# Altium project CreationByte_DevBoard_v1.PrjPcb (part 2 of 2)
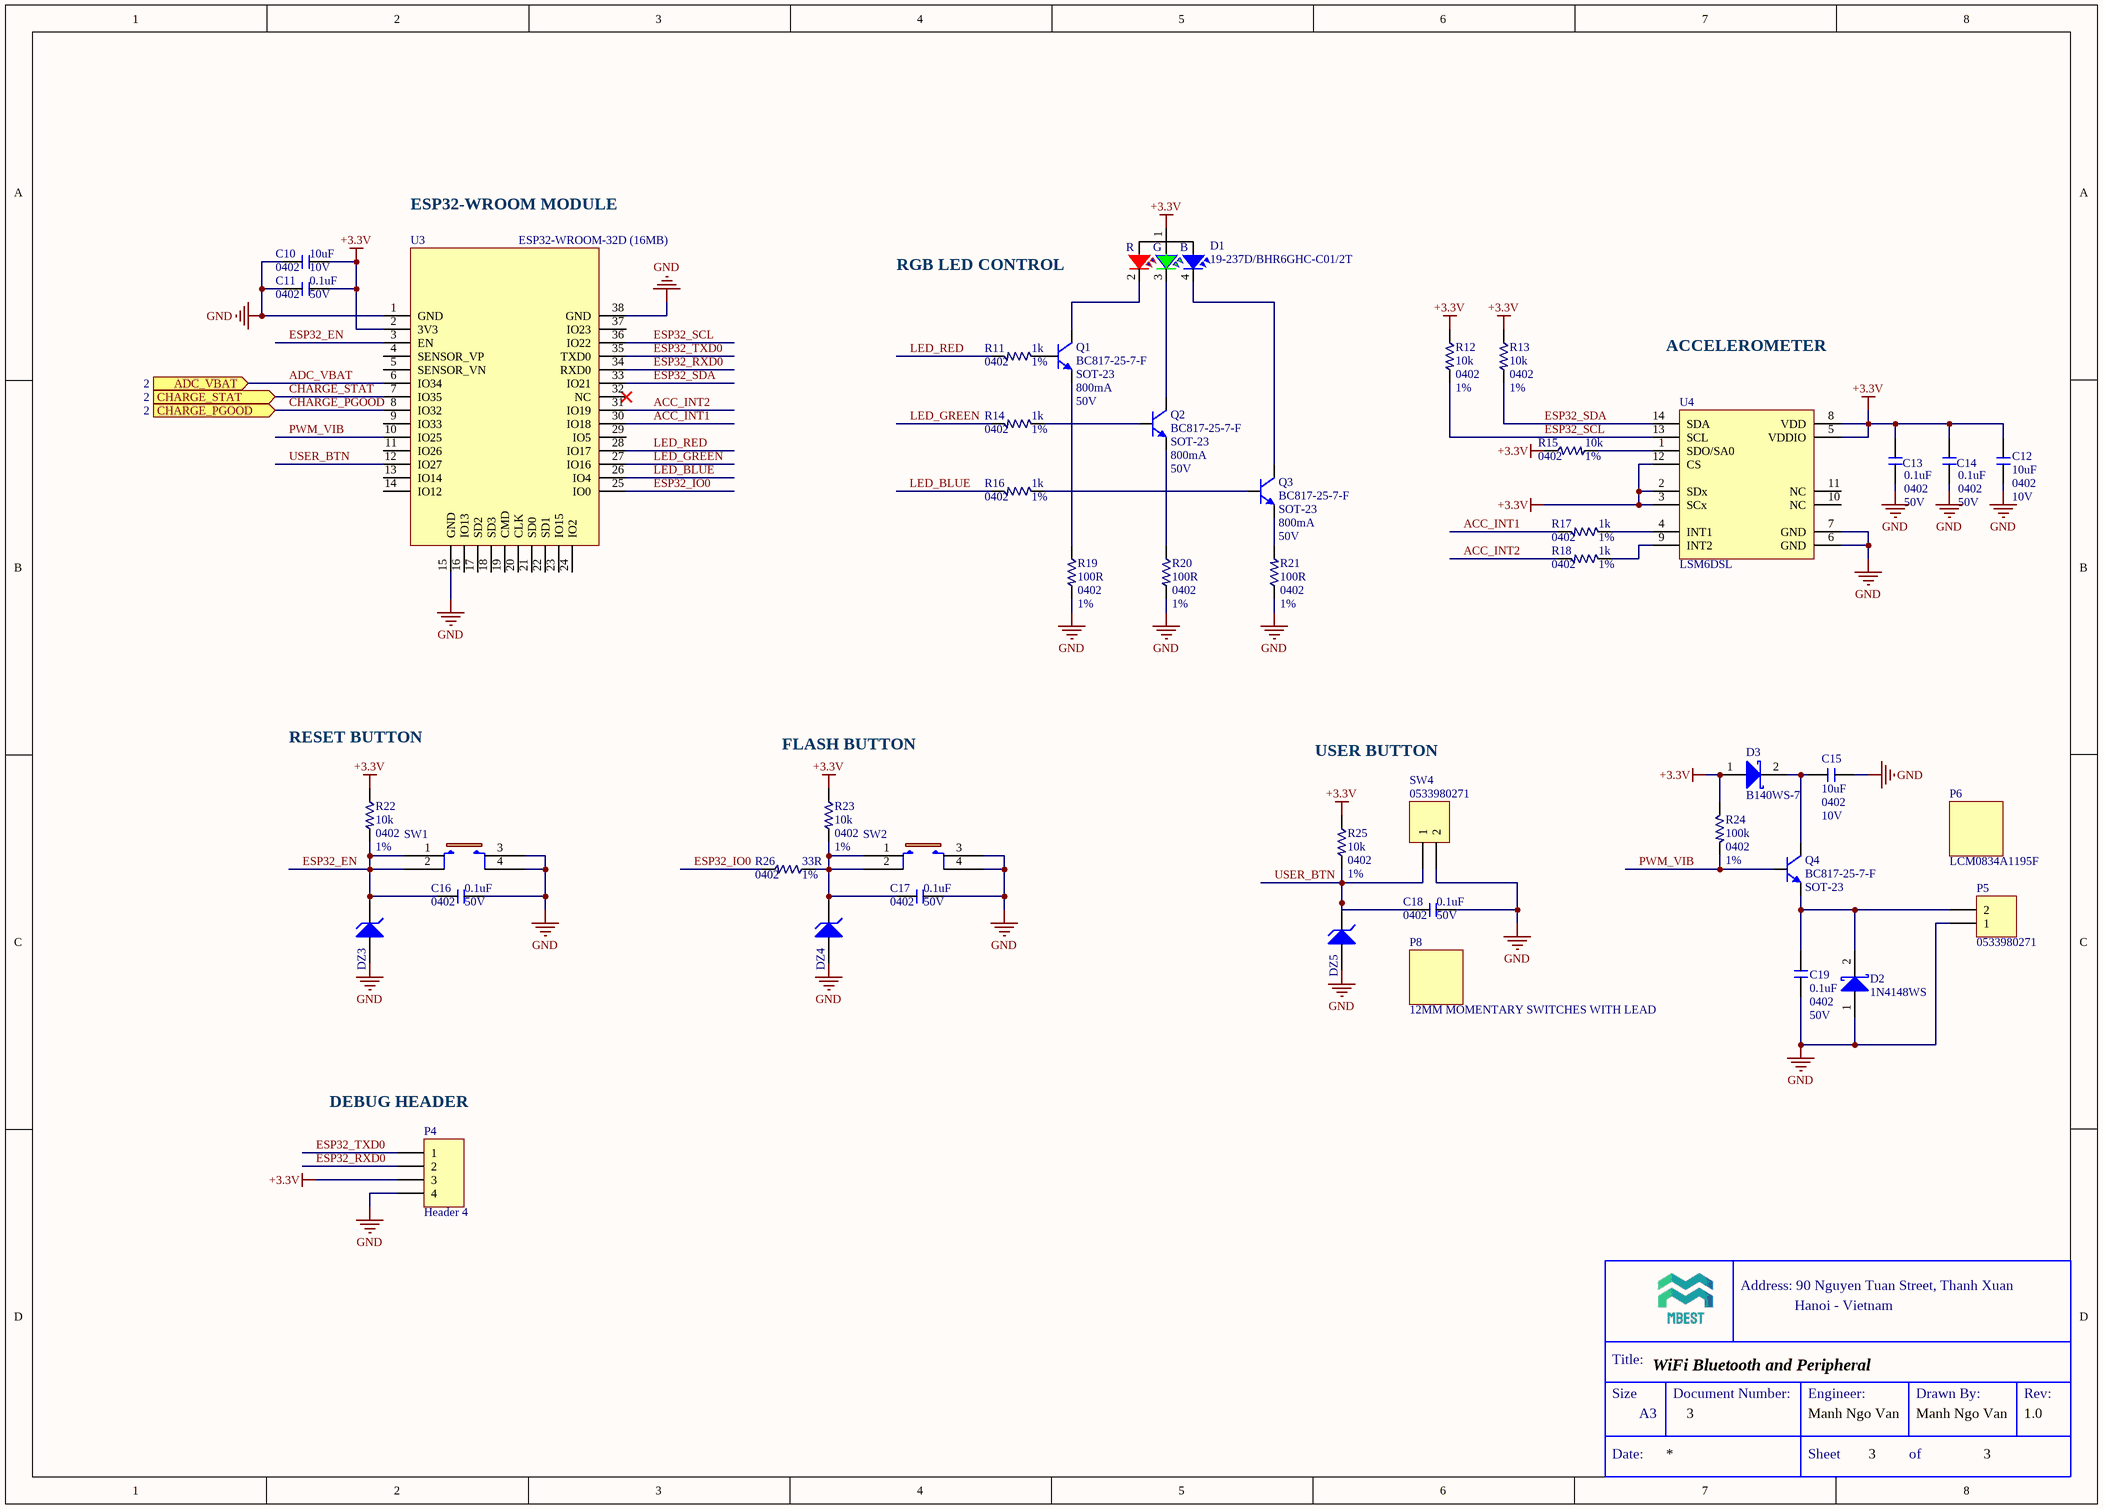
[diagram p3: ESP32.SchDoc]

## Sheet ESP32.SchDoc: WiFi Bluetooth and Peripheral (continued)

### Library data of the parts
C10 C12 C15 = CAP_CER: CAP CER 10UF 10V X5R 0402; Manufacturer 1: Samsung; Manufacturer Part Number 1: CL05A106MP8NUB8; Mouting Technology: SMT; Tolerance: 20%; Pin: 2; Supplier 1: Digi-Key; Supplier Part Number 1: 1276-6830-6-ND; RoHS: Yes; Category: Ceramic Capacitors; Stock 1: 5372550; Pricing 1: 1=0.37000, 10=0.25800, 50=0.18040, 100=0.15460, 500=0.11598, 1000=0.09793, 2500=0.09278 (USD); Mount: Surface Mount; Case Code (Metric): 1005; Case Code (Imperial): 0402; Min Operating Temperature: -55°C; Max Operating Temperature: 85°C; Packaging: Tape and Reel; Capacitance: 10uF; Length: 0.039inch; Width: 0.02inch; Thickness: 0.035inch; RoHS Compliant: Yes; ComponentLink1URL: http://www.samsungsem.com/kr/support/product-search/mlcc/CL05A106MP8NUB8.jsp?src-supplier=Digi-Key; ComponentLink1Description: http://www.samsungsem.com/kr/support/product-search/mlcc/CL05A106MP8NUB8.jsp?src-supplier=Digi-Key
C11 C13 C14 C16-C19 = CAP_CER: CAP CER 0.1UF 50V X7R 0402; Manufacturer: Murata; Manufacturer Part Number: GRM155R71H104KE14D; Material: Ceramic; Tolerance: 10%; Capacitance: 100nF; Dissipation Factor: 0.025%; ComponentLink1URL: https://datasheet.ciiva.com/25741/cl10b104kb8nnnl-25741341.pdf?src-supplier=Digi-Key; ComponentLink1Description: https://datasheet.ciiva.com/25741/cl10b104kb8nnnl-25741341.pdf?src-supplier=Digi-Key; ComponentLink2URL: https://datasheet.ciiva.com/26838/getdatasheetpartid-357523-26838415.pdf?src-supplier=Verical; ComponentLink2Description: https://datasheet.ciiva.com/26838/getdatasheetpartid-357523-26838415.pdf?src-supplier=Verical; Supplier 1: Digi-Key; Supplier Part Number 1: 490-10700-1-ND; Stock 1: 2282266; Pricing 1: 1 = 0.10000, 10 = 0.04600, 100 = 0.02050, 500 = 0.01464, 1000 = 0.01150, 2500 = 0.01045, 5000 = 0.00961 (USD); RoHS: Yes; Mount: Surface Mount; Weight: 0.000212oz; Case Code (Metric): 1005; Case Code (Imperial): 0402; Dielectric Material: Ceramic; Min Operating Temperature: -55°C; Max Operating Temperature: 125°C; Packaging: Tape and Reel; Dielectric: X7R; Voltage Rating: 50V; Termination: SMD/SMT; Composition: Ceramic; Voltage Rating (DC): 50V; Package Quantity: 10000; Length: 1mm; Height: 0.5mm; Width: 0.5mm; Thickness: 0.022inch; Depth: 0.5mm; REACH SVHC: No SVHC; Lead Free: Lead Free; ComponentLink3URL: http://www.farnell.com/datasheets/2079156.pdf?src-supplier=Farnell; ComponentLink3Description: http://www.farnell.com/datasheets/2079156.pdf?src-supplier=Farnell; ComponentLink4URL: http://www.mouser.com/ds/2/281/c02e-2905.pdf?src-supplier=Mouser; ComponentLink4Description: http://www.mouser.com/ds/2/281/c02e-2905.pdf?src-supplier=Mouser; ComponentLink5URL: http://components.arrow.com/part/dataview/0323_07030614?src-supplier=Arrow+Europe; ComponentLink5Description: http://components.arrow.com/part/dataview/0323_07030614?src-supplier=Arrow+Europe; ComponentLink6URL: https://search.murata.co.jp/Ceramy/image/img/A01X/G101/ENG/GRM155R71H104KE14-01.pdf?src-supplier=Digi-Key; ComponentLink6Description: https://search.murata.co.jp/Ceramy/image/img/A01X/G101/ENG/GRM155R71H104KE14-01.pdf?src-supplier=Digi-Key; ComponentLink7URL: http://psearch.en.murata.com/capacitor/product/GRM155R71H104KE14%23.pdf?src-supplier=Avnet; ComponentLink7Description: http://psearch.en.murata.com/capacitor/product/GRM155R71H104KE14%23.pdf?src-supplier=Avnet; ComponentLink8URL: http://www.farnell.com/datasheets/2079156.pdf?src-supplier=Element14; ComponentLink8Description: http://www.farnell.com/datasheets/2079156.pdf?src-supplier=Element14; ComponentLink9URL: http://www.farnell.com/datasheets/2079156.pdf?src-supplier=Newark; ComponentLink9Description: http://www.farnell.com/datasheets/2079156.pdf?src-supplier=Newark
D1 = 19-237D/BHR6GHC-C01/2T: LED RGB CLEAR 4SMD; Manufacturer 1: Everlight; Supplier 1: Arrow Electronics; Manufacturer Part Number 1: 19-237D/BHR6GHC-C01/2T; Pricing 1: 6000=0.27010, 8000=0.26740, 10000=0.26470, 12000=0.26210, 20000=0.25950, 24000=0.25690, 25000=0.25430, 30000=0.25180, 50000=0.24920 (USD); Supplier Part Number 1: 19-237D/BHR6GHC-C01/2T
D2 = D Schottky: DIODE GEN PURP 75V 150MA SOD323F; Manufacturer: ON Semiconductor / Fairchild; Reverse Recovery Time: 4ns; Power Dissipation: 200mW; Element Configuration: Single; Max Forward Surge Current (Ifsm): 2A; Peak Reverse Current: 5uA; Forward Voltage: 1V; ComponentLink1URL: http://www.mccsemi.com/up_pdf/1N4148X(SOD-523).PDF?src-supplier=Digi-Key; ComponentLink1Description: http://www.mccsemi.com/up_pdf/1N4148X(SOD-523).PDF?src-supplier=Digi-Key; ComponentLink2URL: http://www.mouser.com/ds/2/258/1N4148X(SOD-523)-349105.pdf?src-supplier=Mouser; ComponentLink2Description: http://www.mouser.com/ds/2/258/1N4148X(SOD-523)-349105.pdf?src-supplier=Mouser; ComponentLink3URL: http://www.mccsemi.com/up_pdf/1N4148X(SOD-523).PDF?src-supplier=Future+Electronics; ComponentLink3Description: http://www.mccsemi.com/up_pdf/1N4148X(SOD-523).PDF?src-supplier=Future+Electronics; ComponentLink4URL: https://datasheet.ciiva.com/16303/ds30217-16303296.pdf?src-supplier=Future+Electronics; ComponentLink4Description: https://datasheet.ciiva.com/16303/ds30217-16303296.pdf?src-supplier=Future+Electronics; ComponentLink5URL: https://datasheet.ciiva.com/27092/1538419-27092484.pdf?src-supplier=Jameco; ComponentLink5Description: https://datasheet.ciiva.com/27092/1538419-27092484.pdf?src-supplier=Jameco; ComponentLink6URL: https://datasheet.ciiva.com/912/ds30217-912801.pdf?src-supplier=Digi-Key; ComponentLink6Description: https://datasheet.ciiva.com/912/ds30217-912801.pdf?src-supplier=Digi-Key; ComponentLink7URL: https://datasheet.ciiva.com/1177/ds30217-1177089.pdf?src-supplier=Element14; ComponentLink7Description: https://datasheet.ciiva.com/1177/ds30217-1177089.pdf?src-supplier=Element14; ComponentLink8URL: https://datasheet.ciiva.com/912/ds30217-912802.pdf?src-supplier=Digi-Key; ComponentLink8Description: https://datasheet.ciiva.com/912/ds30217-912802.pdf?src-supplier=Digi-Key; ComponentLink9URL: https://datasheet.ciiva.com/912/ds30217-912803.pdf?src-supplier=Digi-Key; ComponentLink9Description: https://datasheet.ciiva.com/912/ds30217-912803.pdf?src-supplier=Digi-Key; ComponentLink10URL: https://datasheet.ciiva.com/8303/ds30217-8303132.pdf?src-supplier=Avnet; ComponentLink10Description: https://datasheet.ciiva.com/8303/ds30217-8303132.pdf?src-supplier=Avnet; ComponentLink11URL: https://datasheet.ciiva.com/25919/ds30217-25919644.pdf?src-supplier=Avnet+Europe; ComponentLink11Description: https://datasheet.ciiva.com/25919/ds30217-25919644.pdf?src-supplier=Avnet+Europe; Supplier 1: Digi-Key; Supplier Part Number 1: 1N4148WSFSCT-ND; Manufacturer Part Number: 1N4148WS; Stock 1: 252106; Pricing 1: 1 = 0.16000, 10 = 0.14000, 100 = 0.06610, 500 = 0.03920, 1000 = 0.02576 (USD); RoHS: Yes; Mount: Surface Mount; Number of Pins: 2; Weight: 0.0276g; Contact Plating: Tin,Matte; Min Operating Temperature: -55°C; Max Operating Temperature: 150°C; Max Repetitive Reverse Voltage (Vrrm): 75V; Packaging: Tape and Reel; Forward Current: 150mA; Average Rectified Current: 150mA; Package Quantity: 1; Recovery Time: 4ns; Reverse Voltage: 75V; Max Reverse Voltage (DC): 75V; Length: 1.8mm; Height: 1mm; Width: 1.35mm; Radiation Hardening: No; Lead Free: Lead Free; REACH SVHC: No SVHC; ComponentLink12URL: https://datasheet.ciiva.com/25968/1n914bws-25968945.pdf?src-supplier=Avnet+Europe; ComponentLink12Description: https://datasheet.ciiva.com/25968/1n914bws-25968945.pdf?src-supplier=Avnet+Europe; ComponentLink13URL: https://datasheet.ciiva.com/30479/0900766b810e1cd3-30479206.pdf?src-supplier=RSComponents; ComponentLink13Description: https://datasheet.ciiva.com/30479/0900766b810e1cd3-30479206.pdf?src-supplier=RSComponents; ComponentLink14URL: https://datasheet.ciiva.com/910/1n4148ws-910381.pdf?src-supplier=Digi-Key; ComponentLink14Description: https://datasheet.ciiva.com/910/1n4148ws-910381.pdf?src-supplier=Digi-Key; ComponentLink15URL: https://datasheet.ciiva.com/15208/getdatasheetpartid-127819-15208358.pdf?src-supplier=Verical; ComponentLink15Description: https://datasheet.ciiva.com/15208/getdatasheetpartid-127819-15208358.pdf?src-supplier=Verical; ComponentLink16URL: https://datasheet.ciiva.com/8300/1n914bws-8300360.pdf?src-supplier=Avnet; ComponentLink16Description: https://datasheet.ciiva.com/8300/1n914bws-8300360.pdf?src-supplier=Avnet; ComponentLink17URL: https://datasheet.ciiva.com/910/1n4148ws-910380.pdf?src-supplier=Digi-Key; ComponentLink17Description: https://datasheet.ciiva.com/910/1n4148ws-910380.pdf?src-supplier=Digi-Key; ComponentLink18URL: https://datasheet.ciiva.com/910/1n4148ws-910382.pdf?src-supplier=Digi-Key; ComponentLink18Description: https://datasheet.ciiva.com/910/1n4148ws-910382.pdf?src-supplier=Digi-Key
D3 = D Schottky: DIODE SCHOTTKY 40V 1A SOD323; Manufacturer 1: Diodes; Max Reverse Current: 50uA; Peak Non-Repetitive Surge Current: 3A; Element Configuration: Single; Forward Voltage: 620mV; Natural Thermal Resistance: 426°C/W; Supplier 1: Digi-Key; Supplier Part Number 1: B140WS-7DICT-ND; Manufacturer Part Number 1: B140WS-7; RoHS: Yes; Category: Rectifier Diodes; Stock 1: 30918; Pricing 1: 1=0.43000, 10=0.32200, 100=0.20060, 500=0.13728, 1000=0.10560 (USD); Mount: Surface Mount; Number of Pins: 2; Weight: 0.000173oz; Contact Plating: Tin,Matte; Min Operating Temperature: -40°C; Max Operating Temperature: 125°C; Forward Current: 1A; Max Repetitive Reverse Voltage (Vrrm): 40V; Package Quantity: 3000; Packaging: Tape and Reel; Average Rectified Current: 1A; Max Forward Surge Current (Ifsm): 3A; Max Reverse Voltage (DC): 40V; Series: -; Length: 1.8mm; Width: 1.4mm; Height: 1.1mm; RoHS Compliant: Yes; ComponentLink1URL: https://datasheet.ciiva.com/13064/ds31543-56649-13064032.pdf?src-supplier=Mouser; ComponentLink1Description: https://datasheet.ciiva.com/13064/ds31543-56649-13064032.pdf?src-supplier=Mouser; ComponentLink2URL: https://datasheet.ciiva.com/18567/ds31543-18567697.pdf?src-supplier=Digi-Key; ComponentLink2Description: https://datasheet.ciiva.com/18567/ds31543-18567697.pdf?src-supplier=Digi-Key; ComponentLink3URL: https://datasheet.ciiva.com/25946/ds31543-25946915.pdf?src-supplier=Avnet+Europe; ComponentLink3Description: https://datasheet.ciiva.com/25946/ds31543-25946915.pdf?src-supplier=Avnet+Europe
DZ3-DZ5 = D Zener: TVS DIODE 5.5V 14V 2X1SON; Manufacturer: Texas Instruments; Capacitance: 12pF; Direction: Bidirectional; Breakdown Voltage: 6V; Number of Channels: 1; Peak Pulse Power: 90W; Power Line Protection: No; Leakage Current: 100nA; ESD Protection: Yes; Test Current: 1mA; Element Configuration: Single; Peak Pulse Current: 5A; Interface: GPIO; Supplier 1: Digi-Key; Supplier Part Number 1: 296-30406-1-ND; Manufacturer Part Number: TPD1E10B06DPYR; Stock 1: 555750; Pricing 1: 1 = 0.45000, 10 = 0.29400, 100 = 0.16380, 500 = 0.10920, 1000 = 0.07560, 5000 = 0.07350 (USD); RoHS: Yes; Case/Package: 0402; Number of Pins: 2; Contact Plating: Gold; Min Operating Temperature: -40°C; Max Operating Temperature: 125°C; Package Quantity: 1; Packaging: Tape and Reel; Number of Bidirectional Channels: 1; Reverse Standoff Voltage: 5.5V; Min Breakdown Voltage: 6V; Clamping Voltage: 14V; Working Voltage: 5.5V; Max Reverse Leakage Current: 100nA; Resistor Type: Zener; Length: 1.1mm; Height: 0.35mm; Width: 0.7mm; Radiation Hardening: No; REACH SVHC: No SVHC; Lead Free: Lead Free; ComponentLink1URL: https://datasheet.ciiva.com/26005/sllseb1b-26005840.pdf?src-supplier=Avnet+Europe; ComponentLink1Description: https://datasheet.ciiva.com/26005/sllseb1b-26005840.pdf?src-supplier=Avnet+Europe; ComponentLink2URL: https://datasheet.ciiva.com/46384/1877100-46384054.pdf?src-supplier=Element14; ComponentLink2Description: https://datasheet.ciiva.com/46384/1877100-46384054.pdf?src-supplier=Element14; ComponentLink3URL: https://datasheet.ciiva.com/14195/tpd1e10b06-14195178.pdf?src-supplier=Avnet; ComponentLink3Description: https://datasheet.ciiva.com/14195/tpd1e10b06-14195178.pdf?src-supplier=Avnet; ComponentLink4URL: https://datasheet.ciiva.com/22691/1877100-22691786.pdf?src-supplier=Element14; ComponentLink4Description: https://datasheet.ciiva.com/22691/1877100-22691786.pdf?src-supplier=Element14; ComponentLink5URL: https://datasheet.ciiva.com/2961/tpd1e10b06-2961245.pdf?src-supplier=Digi-Key; ComponentLink5Description: https://datasheet.ciiva.com/2961/tpd1e10b06-2961245.pdf?src-supplier=Digi-Key; ComponentLink6URL: https://datasheet.ciiva.com/2961/tpd1e10b06-2961246.pdf?src-supplier=Digi-Key; ComponentLink6Description: https://datasheet.ciiva.com/2961/tpd1e10b06-2961246.pdf?src-supplier=Digi-Key; ComponentLink7URL: https://datasheet.ciiva.com/6574/tpd1e10b06-6574654.pdf?src-supplier=Digi-Key; ComponentLink7Description: https://datasheet.ciiva.com/6574/tpd1e10b06-6574654.pdf?src-supplier=Digi-Key
P4 = Header 4: Header, 4-Pin; LatestRevisionDate: 17-Jul-2002; LatestRevisionNote: Re-released for DXP Platform.; Publisher: Altium Limited
P5 SW4 = Header 2: CONN HEADER SMD 2POS 1.25MM; Manufacturer 1: Molex; Manufacturer Part Number 1: 53398-0271; Current Rating: 1A; Voltage Rating (AC): 125V; Contact Resistance: 20mR; Number of Positions: 2; Insulation Resistance: 100MR; Gender: Male; Glow Wire Compliant: Non-compliant; LatestRevisionDate: 17-Jul-2002; LatestRevisionNote: Re-released for DXP Platform.; Publisher: Altium Limited; Supplier 1: Digi-Key; Supplier Part Number 1: WM7606CT-ND; RoHS: Yes; Category: Headers and Wire Housings; Stock 1: 417; Pricing 1: 1=0.53000, 10=0.44900, 100=0.34940 (USD); Mount: Surface Mount; Contact Material: Bronze,Brass,Tin; Contact Plating: Tin; Color: Natural; Housing Color: Natural; Housing Material: Nylon; Min Operating Temperature: -40°C; Max Operating Temperature: 85°C; Number of Rows: 1; Packaging: Tape and Reel; Package Quantity: 1000; Voltage Rating: 125V; Termination: Solder; Number of Contacts: 2; Working Voltage: 125V; Orientation: Vertical; Number of Circuits: 2; Voltage Rating (DC): 125V; Series: PicoBlade; Contact Type: Blade Pin; Pitch: 1.25mm; Depth: 4.2mm; Radiation Hardening: No; RoHS Compliant: Yes; REACH SVHC: Unknown; Lead Free: Lead Free; Flammability Rating: UL94 V-0; ComponentLink1URL: https://datasheet.ciiva.com/7167/1626130-7167520.pdf?src-supplier=Newark; ComponentLink1Description: https://datasheet.ciiva.com/7167/1626130-7167520.pdf?src-supplier=Newark; ComponentLink2URL: https://datasheet.ciiva.com/7920/1841150-7920834.pdf?src-supplier=Element14; ComponentLink2Description: https://datasheet.ciiva.com/7920/1841150-7920834.pdf?src-supplier=Element14; ComponentLink3URL: https://datasheet.ciiva.com/14156/gf116833-116846-e-14156243.pdf?src-supplier=Distrelec; ComponentLink3Description: https://datasheet.ciiva.com/14156/gf116833-116846-e-14156243.pdf?src-supplier=Distrelec; ComponentLink4URL: https://datasheet.ciiva.com/36178/1932619-36178944.pdf?src-supplier=Jameco; ComponentLink4Description: https://datasheet.ciiva.com/36178/1932619-36178944.pdf?src-supplier=Jameco; ComponentLink5URL: https://datasheet.ciiva.com/28523/1759360-28523372.pdf?src-supplier=Element14; ComponentLink5Description: https://datasheet.ciiva.com/28523/1759360-28523372.pdf?src-supplier=Element14; ComponentLink6URL: https://datasheet.ciiva.com/9468/0533980271-pcb-headers-9468512.pdf?src-supplier=Avnet; ComponentLink6Description: https://datasheet.ciiva.com/9468/0533980271-pcb-headers-9468512.pdf?src-supplier=Avnet; ComponentLink7URL: https://datasheet.ciiva.com/30229/225140533980271-pcb-headers-30229043.pdf?src-supplier=Onlinecomponents.com; ComponentLink7Description: https://datasheet.ciiva.com/30229/225140533980271-pcb-headers-30229043.pdf?src-supplier=Onlinecomponents.com; ComponentLink8URL: https://datasheet.ciiva.com/5150/0533980271-pcb-headers-146564-5150549.pdf?src-supplier=Mouser; ComponentLink8Description: https://datasheet.ciiva.com/5150/0533980271-pcb-headers-146564-5150549.pdf?src-supplier=Mouser; ComponentLink9URL: https://datasheet.ciiva.com/11746/0900766b80ab946a-11746463.pdf?src-supplier=RSComponents; ComponentLink9Description: https://datasheet.ciiva.com/11746/0900766b80ab946a-11746463.pdf?src-supplier=RSComponents; ComponentLink10URL: https://datasheet.ciiva.com/22707/1867379-22707654.pdf?src-supplier=Element14; ComponentLink10Description: https://datasheet.ciiva.com/22707/1867379-22707654.pdf?src-supplier=Element14; ComponentLink11URL: https://datasheet.ciiva.com/22683/1626130-22683563.pdf?src-supplier=Element14; ComponentLink11Description: https://datasheet.ciiva.com/22683/1626130-22683563.pdf?src-supplier=Element14; ComponentLink12URL: https://datasheet.ciiva.com/16658/0533980271-pcb-headers-16658429.pdf?src-supplier=Avnet+Europe; ComponentLink12Description: https://datasheet.ciiva.com/16658/0533980271-pcb-headers-16658429.pdf?src-supplier=Avnet+Europe; ComponentLink13URL: https://datasheet.ciiva.com/18454/70090670-18454279.pdf?src-supplier=Allied+Electronics; ComponentLink13Description: https://datasheet.ciiva.com/18454/70090670-18454279.pdf?src-supplier=Allied+Electronics
P6 = ADDITION: Coin Type Vibration Motor; Manufacturer 1: LEADER; Manufacturer Part Number 1: LCM0834A1195F
P8 = ADDITION: Manufacturer 1: Yueqing Taixin Electric Co; Manufacturer Part Number 1: 12MM MOMENTARY SWITCHES WITH LEAD; ComponentLink1Description: New link; ComponentLink1URL: https://www.alibaba.com/product-detail/12mm-16mm-19mm-22mm-reset-screw_60833334002.html?spm=a2700.galleryofferlist.normal_offer.d_title.6c1e33b1BOO0Mu
Q1-Q3 = MMBT3904-7-F: TRANS NPN 45V 500MA SOT23-3; Manufacturer 1: Diodes; Max Power Dissipation: 310mW; Number of Elements: 1; Frequency: 100MHz; Emitter Base Voltage (VEBO): 5V; Collector Emitter Saturation Voltage: 700mV; Max Breakdown Voltage: 150V; Power Dissipation: 350mW; Element Configuration: Single; Supplier 1: Digi-Key; Supplier Part Number 1: BC817-25FDICT-ND; Manufacturer Part Number 1: BC817-25-7-F; Stock 1: 52922; Pricing 1: 1 = 0.20000, 10 = 0.16300, 25 = 0.13640, 100 = 0.06670, 250 = 0.06560, 500 = 0.05560, 1000 = 0.03863 (USD); RoHS: Yes; Mount: Surface Mount; Number of Pins: 3; Weight: 0.000282oz; Contact Plating: Tin; Min Operating Temperature: -65°C; Max Operating Temperature: 150°C; Collector Emitter Voltage (VCEO): 45V; Polarity: NPN; Packaging: Tape and Reel; Collector Emitter Breakdown Voltage: 45V; Package Quantity: 3000; Transition Frequency: 100MHz; Max Frequency: 100MHz; Gain Bandwidth Product: 100MHz; Length: 3.05mm; Height: 1mm; Width: 1.4mm; Radiation Hardening: No; REACH SVHC: No SVHC; Lead Free: Lead Free; ComponentLink1URL: https://datasheet.ciiva.com/15139/getdatasheetpartid-233998-15139790.pdf?src-supplier=Verical; ComponentLink1Description: https://datasheet.ciiva.com/15139/getdatasheetpartid-233998-15139790.pdf?src-supplier=Verical; Manufacturer: Diodes; Manufacturer Part Number: BC817-25-7-F
Q4 = MMBT3904-7-F: TRANS NPN 45V 500MA SOT23-3; Manufacturer 1: Diodes; Max Power Dissipation: 310mW; Max Collector Current: 800mA; Number of Elements: 1; Frequency: 100MHz; Collector Base Voltage (VCBO): 50V; Emitter Base Voltage (VEBO): 5V; Collector Emitter Saturation Voltage: 700mV; Max Breakdown Voltage: 150V; Power Dissipation: 350mW; Element Configuration: Single; Supplier 1: Digi-Key; Supplier Part Number 1: BC817-25FDICT-ND; Manufacturer Part Number 1: BC817-25-7-F; Stock 1: 52922; Pricing 1: 1 = 0.20000, 10 = 0.16300, 25 = 0.13640, 100 = 0.06670, 250 = 0.06560, 500 = 0.05560, 1000 = 0.03863 (USD); RoHS: Yes; Mount: Surface Mount; Number of Pins: 3; Weight: 0.000282oz; Contact Plating: Tin; Min Operating Temperature: -65°C; Max Operating Temperature: 150°C; Collector Emitter Voltage (VCEO): 45V; Polarity: NPN; Packaging: Tape and Reel; Collector Emitter Breakdown Voltage: 45V; Package Quantity: 3000; Transition Frequency: 100MHz; Max Frequency: 100MHz; Gain Bandwidth Product: 100MHz; Length: 3.05mm; Height: 1mm; Width: 1.4mm; Radiation Hardening: No; REACH SVHC: No SVHC; Lead Free: Lead Free; ComponentLink1URL: https://datasheet.ciiva.com/15139/getdatasheetpartid-233998-15139790.pdf?src-supplier=Verical; ComponentLink1Description: https://datasheet.ciiva.com/15139/getdatasheetpartid-233998-15139790.pdf?src-supplier=Verical; Manufacturer: Diodes; Manufacturer Part Number: BC817-25-7-F
R11 R14 R16-R18 = RES_SMD: RES SMD 1K OHM 1% 1/16W 0402; Manufacturer 1: Yageo; Manufacturer Part Number 1: RC0402FR-071KL; Mouting Technology: SMT; Resistance: 1kR; Temperature Coefficient: 100ppm/°C; Voltage Rating (DC): 50V; Power Rating: 62.5mW; Max Power Dissipation: 63mW; Pin: 2; Supplier 1: Digi-Key; Supplier Part Number 1: 311-1.00KLRCT-ND; RoHS: Yes; Category: Chip SMD Resistors; Pricing 1: 1=0.10000, 10=0.01600, 100=0.00660, 1000=0.00299, 2500=0.00259, 5000=0.00214 (USD); Number of Pins: 2; Case Code (Imperial): 0402; Case Code (Metric): 1005; Size Code: 0402; Min Operating Temperature: -55°C; Max Operating Temperature: 155°C; Resistor Type: Thick Film; Packaging: Tape and Reel; Voltage Rating: 50V; Termination: SMD/SMT; Features: Moisture Resistant; Series: RC; Number of Terminations: 2; Resistance Tolerance: 1%; Construction: Rectangular; Technology: THICK FILM; Length: 1mm; Width: 0.5mm; Height: 0.32mm; Depth: 0.5mm; REACH SVHC: Unknown; Lead Free: Lead Free; RoHS Compliant: Yes; Military Standard: Not; ComponentLink1URL: https://datasheet.ciiva.com/11819/0900766b80c66297-11819477.pdf?src-supplier=RSComponents; ComponentLink1Description: https://datasheet.ciiva.com/11819/0900766b80c66297-11819477.pdf?src-supplier=RSComponents; ComponentLink2URL: https://datasheet.ciiva.com/7983/1018594-7983502.pdf?src-supplier=Element14; ComponentLink2Description: https://datasheet.ciiva.com/7983/1018594-7983502.pdf?src-supplier=Element14; ComponentLink3URL: https://datasheet.ciiva.com/22747/1018594-22747513.pdf?src-supplier=Element14; ComponentLink3Description: https://datasheet.ciiva.com/22747/1018594-22747513.pdf?src-supplier=Element14; ComponentLink4URL: https://datasheet.ciiva.com/12666/pyu-rc0402-51-rohs-l-6-r-12666741.pdf?src-supplier=Mouser; ComponentLink4Description: https://datasheet.ciiva.com/12666/pyu-rc0402-51-rohs-l-6-r-12666741.pdf?src-supplier=Mouser; ComponentLink5URL: https://datasheet.ciiva.com/7849/1018594-7849869.pdf?src-supplier=Element14; ComponentLink5Description: https://datasheet.ciiva.com/7849/1018594-7849869.pdf?src-supplier=Element14; ComponentLink6URL: https://datasheet.ciiva.com/7849/1018594-7849871.pdf?src-supplier=Element14; ComponentLink6Description: https://datasheet.ciiva.com/7849/1018594-7849871.pdf?src-supplier=Element14; ComponentLink7URL: https://datasheet.ciiva.com/17063/pyu-rc0402-51-rohs-l-6-r-17063193.pdf?src-supplier=Future+Electronics; ComponentLink7Description: https://datasheet.ciiva.com/17063/pyu-rc0402-51-rohs-l-6-r-17063193.pdf?src-supplier=Future+Electronics
R12 R13 R15 R22 R23 R25 = RES_SMD: RES SMD 10K OHM 1% 1/16W 0402; Manufacturer: Yageo; Manufacturer Part Number: RC0402FR-0710KL; Resistance: 10kR; Temperature Coefficient: 100ppm/°C; Voltage Rating (DC): 50V; Power Rating: 62.5mW; Supplier 1: Digi-Key; Supplier Part Number 1: 311-10.0KLRTR-ND; Stock 1: 58760000; Pricing 1: 10000 = 0.001630, 30000 = 0.001440, 50000 = 0.001320, 100000 = 0.001290 (USD); RoHS: Yes; Case/Package: 0402; Number of Pins: 2; Case Code (Metric): 1005; Min Operating Temperature: -55°C; Max Operating Temperature: 155°C; Composition: Thick Film; Packaging: Tape and Reel; Voltage Rating: 50V; Termination: SMD/SMT; Military Standard: Not; Working Voltage: 50V; Number of Terminations: 2; Length: 1mm; Height: 0.32mm; Width: 0.5mm; Depth: 0.5mm; Lead Pitch: 0.2mm; REACH SVHC: No SVHC; Lead Free: Lead Free; ComponentLink1URL: https://datasheet.ciiva.com/7660/38568-7660787.pdf?src-supplier=Element14; ComponentLink1Description: https://datasheet.ciiva.com/7660/38568-7660787.pdf?src-supplier=Element14; ComponentLink2URL: https://datasheet.ciiva.com/7849/1784430-7849813.pdf?src-supplier=Element14; ComponentLink2Description: https://datasheet.ciiva.com/7849/1784430-7849813.pdf?src-supplier=Element14; ComponentLink3URL: https://datasheet.ciiva.com/7849/1686128-7849814.pdf?src-supplier=Element14; ComponentLink3Description: https://datasheet.ciiva.com/7849/1686128-7849814.pdf?src-supplier=Element14; ComponentLink4URL: https://datasheet.ciiva.com/7849/1784430-7849815.pdf?src-supplier=Element14; ComponentLink4Description: https://datasheet.ciiva.com/7849/1784430-7849815.pdf?src-supplier=Element14; ComponentLink5URL: https://datasheet.ciiva.com/22747/1018594-22747512.pdf?src-supplier=Element14; ComponentLink5Description: https://datasheet.ciiva.com/22747/1018594-22747512.pdf?src-supplier=Element14; ComponentLink6URL: https://datasheet.ciiva.com/12667/pyu-rc0402-51-rohs-l-6-r-12667067.pdf?src-supplier=Mouser; ComponentLink6Description: https://datasheet.ciiva.com/12667/pyu-rc0402-51-rohs-l-6-r-12667067.pdf?src-supplier=Mouser; ComponentLink7URL: https://datasheet.ciiva.com/7983/1018594-7983486.pdf?src-supplier=Element14; ComponentLink7Description: https://datasheet.ciiva.com/7983/1018594-7983486.pdf?src-supplier=Element14
R19 = RES_SMD: RES SMD 100 OHM 1% 1/16W 0402; Manufacturer 1: Yageo; Manufacturer Part Number 1: RC0402FR-07100RL; Working Voltage: 50V; Power Rating: 62.5mW; Temperature Coefficient: 100ppm/°C; Max Power Dissipation: 63mW; Contact Plating: Tin,Matte; Radiation Hardening: No; Weight: 7.1E-05oz; Number of Terminations: 2; Height: 0.022inch; Supplier 1: Digi-Key; Supplier Part Number 1: 311-100LRCT-ND; RoHS: Yes; Category: Chip SMD Resistors; Stock 1: 99211; Pricing 1: 1=0.10000, 10=0.01600, 100=0.00660, 1000=0.00299, 2500=0.00259, 5000=0.00214 (USD); Case/Package: 0402; Number of Pins: 2; Case Code (Metric): 1005; Size Code: 0402; Min Operating Temperature: -55°C; Max Operating Temperature: 155°C; Voltage Rating: 50V; Voltage Rating (DC): 50V; Resistance: 100R; Packaging: Tape and Reel; Termination: SMD/SMT; Resistor Type: Thick Film; Features: Moisture Resistant; Series: RC; Resistance Tolerance: 1%; Construction: Rectangular; Technology: THICK FILM; Length: 1mm; Width: 0.5mm; Depth: 0.5mm; RoHS Compliant: Yes; REACH SVHC: No SVHC; Military Standard: Not; Lead Free: Lead Free; ComponentLink1URL: https://datasheet.ciiva.com/7849/1784430-7849810.pdf?src-supplier=Element14; ComponentLink1Description: https://datasheet.ciiva.com/7849/1784430-7849810.pdf?src-supplier=Element14; ComponentLink2URL: https://datasheet.ciiva.com/11808/0900766b80c66297-11808765.pdf?src-supplier=RSComponents; ComponentLink2Description: https://datasheet.ciiva.com/11808/0900766b80c66297-11808765.pdf?src-supplier=RSComponents; ComponentLink3URL: https://datasheet.ciiva.com/12667/pyu-rc0402-51-rohs-l-6-r-12667957.pdf?src-supplier=Mouser; ComponentLink3Description: https://datasheet.ciiva.com/12667/pyu-rc0402-51-rohs-l-6-r-12667957.pdf?src-supplier=Mouser; ComponentLink4URL: https://datasheet.ciiva.com/16740/pyu-rc0402-51-rohs-l-6-r-16740566.pdf?src-supplier=Future+Electronics; ComponentLink4Description: https://datasheet.ciiva.com/16740/pyu-rc0402-51-rohs-l-6-r-16740566.pdf?src-supplier=Future+Electronics; ComponentLink5URL: https://datasheet.ciiva.com/15189/getdatasheetpartid-329466-15189335.pdf?src-supplier=Verical; ComponentLink5Description: https://datasheet.ciiva.com/15189/getdatasheetpartid-329466-15189335.pdf?src-supplier=Verical; ComponentLink6URL: https://datasheet.ciiva.com/22747/1018594-22747511.pdf?src-supplier=Element14; ComponentLink6Description: https://datasheet.ciiva.com/22747/1018594-22747511.pdf?src-supplier=Element14; ComponentLink7URL: https://datasheet.ciiva.com/28367/1018594-28367226.pdf?src-supplier=Element14; ComponentLink7Description: https://datasheet.ciiva.com/28367/1018594-28367226.pdf?src-supplier=Element14
R20 R21 = RES_SMD: RES SMD 100 OHM 1% 1/16W 0402; Manufacturer 1: Yageo; Manufacturer Part Number 1: RC0402FR-07100RL; Power Rating: 62.5mW; Voltage Rating: 50V; Temperature Coefficient: 100ppm/°C; Max Power Dissipation: 63mW; Number of Terminations: 2; Supplier 1: Digi-Key; Supplier Part Number 1: 311-100LRCT-ND; RoHS: Yes; Category: Chip SMD Resistors; Stock 1: 99211; Pricing 1: 1=0.10000, 10=0.01600, 100=0.00660, 1000=0.00299, 2500=0.00259, 5000=0.00214 (USD); Case/Package: 0402; Number of Pins: 2; Case Code (Metric): 1005; Size Code: 0402; Min Operating Temperature: -55°C; Max Operating Temperature: 155°C; Voltage Rating (DC): 50V; Resistance: 100R; Packaging: Tape and Reel; Termination: SMD/SMT; Resistor Type: Thick Film; Features: Moisture Resistant; Series: RC; Resistance Tolerance: 1%; Construction: Rectangular; Technology: THICK FILM; Length: 1mm; Width: 0.5mm; Depth: 0.5mm; RoHS Compliant: Yes; REACH SVHC: No SVHC; Military Standard: Not; Lead Free: Lead Free
  R20: ComponentLink1URL: https://datasheet.ciiva.com/17358/pyu-rc0402-51-rohs-l-6-r-17358406.pdf?src-supplier=Future+Electronics; ComponentLink1Description: https://datasheet.ciiva.com/17358/pyu-rc0402-51-rohs-l-6-r-17358406.pdf?src-supplier=Future+Electronics; ComponentLink2URL: https://datasheet.ciiva.com/7850/1018594-7850200.pdf?src-supplier=Element14; ComponentLink2Description: https://datasheet.ciiva.com/7850/1018594-7850200.pdf?src-supplier=Element14; ComponentLink3URL: https://datasheet.ciiva.com/46394/1018594-46394968.pdf?src-supplier=Element14; ComponentLink3Description: https://datasheet.ciiva.com/46394/1018594-46394968.pdf?src-supplier=Element14; ComponentLink4URL: https://datasheet.ciiva.com/7850/1018594-7850201.pdf?src-supplier=Element14; ComponentLink4Description: https://datasheet.ciiva.com/7850/1018594-7850201.pdf?src-supplier=Element14; ComponentLink5URL: https://datasheet.ciiva.com/7983/1018594-7983579.pdf?src-supplier=Element14; ComponentLink5Description: https://datasheet.ciiva.com/7983/1018594-7983579.pdf?src-supplier=Element14; ComponentLink6URL: https://datasheet.ciiva.com/2518/pyu-r-int-thick-7-2518940.pdf?src-supplier=Digi-Key; ComponentLink6Description: https://datasheet.ciiva.com/2518/pyu-r-int-thick-7-2518940.pdf?src-supplier=Digi-Key; ComponentLink7URL: https://datasheet.ciiva.com/2518/pyu-r-int-thick-7-2518941.pdf?src-supplier=Digi-Key; ComponentLink7Description: https://datasheet.ciiva.com/2518/pyu-r-int-thick-7-2518941.pdf?src-supplier=Digi-Key; ComponentLink8URL: https://datasheet.ciiva.com/2518/pyu-r-int-thick-7-2518942.pdf?src-supplier=Digi-Key; ComponentLink8Description: https://datasheet.ciiva.com/2518/pyu-r-int-thick-7-2518942.pdf?src-supplier=Digi-Key; Height: 0.022inch; ComponentLink9URL: https://datasheet.ciiva.com/2452/pyu-r-int-thick-7-2452896.pdf?src-supplier=Digi-Key; ComponentLink9Description: https://datasheet.ciiva.com/2452/pyu-r-int-thick-7-2452896.pdf?src-supplier=Digi-Key; ComponentLink10URL: https://datasheet.ciiva.com/2452/pyu-r-int-thick-7-2452897.pdf?src-supplier=Digi-Key; ComponentLink10Description: https://datasheet.ciiva.com/2452/pyu-r-int-thick-7-2452897.pdf?src-supplier=Digi-Key; ComponentLink11URL: https://datasheet.ciiva.com/2452/pyu-r-int-thick-7-2452898.pdf?src-supplier=Digi-Key; ComponentLink11Description: https://datasheet.ciiva.com/2452/pyu-r-int-thick-7-2452898.pdf?src-supplier=Digi-Key; ComponentLink12URL: https://datasheet.ciiva.com/7746/1868787-7746491.pdf?src-supplier=Element14; ComponentLink12Description: https://datasheet.ciiva.com/7746/1868787-7746491.pdf?src-supplier=Element14; ComponentLink13URL: https://datasheet.ciiva.com/46395/443971-46395147.pdf?src-supplier=Element14; ComponentLink13Description: https://datasheet.ciiva.com/46395/443971-46395147.pdf?src-supplier=Element14; ComponentLink14URL: https://datasheet.ciiva.com/7746/443971-7746492.pdf?src-supplier=Element14; ComponentLink14Description: https://datasheet.ciiva.com/7746/443971-7746492.pdf?src-supplier=Element14; ComponentLink15URL: https://datasheet.ciiva.com/7849/1784430-7849810.pdf?src-supplier=Element14; ComponentLink15Description: https://datasheet.ciiva.com/7849/1784430-7849810.pdf?src-supplier=Element14; ComponentLink16URL: https://datasheet.ciiva.com/11808/0900766b80c66297-11808765.pdf?src-supplier=RSComponents; ComponentLink16Description: https://datasheet.ciiva.com/11808/0900766b80c66297-11808765.pdf?src-supplier=RSComponents; ComponentLink17URL: https://datasheet.ciiva.com/12667/pyu-rc0402-51-rohs-l-6-r-12667957.pdf?src-supplier=Mouser; ComponentLink17Description: https://datasheet.ciiva.com/12667/pyu-rc0402-51-rohs-l-6-r-12667957.pdf?src-supplier=Mouser; ComponentLink18URL: https://datasheet.ciiva.com/16740/pyu-rc0402-51-rohs-l-6-r-16740566.pdf?src-supplier=Future+Electronics; ComponentLink18Description: https://datasheet.ciiva.com/16740/pyu-rc0402-51-rohs-l-6-r-16740566.pdf?src-supplier=Future+Electronics; ComponentLink19URL: https://datasheet.ciiva.com/15189/getdatasheetpartid-329466-15189335.pdf?src-supplier=Verical; ComponentLink19Description: https://datasheet.ciiva.com/15189/getdatasheetpartid-329466-15189335.pdf?src-supplier=Verical; ComponentLink20URL: https://datasheet.ciiva.com/22747/1018594-22747511.pdf?src-supplier=Element14; ComponentLink20Description: https://datasheet.ciiva.com/22747/1018594-22747511.pdf?src-supplier=Element14; ComponentLink21URL: https://datasheet.ciiva.com/28367/1018594-28367226.pdf?src-supplier=Element14; ComponentLink21Description: https://datasheet.ciiva.com/28367/1018594-28367226.pdf?src-supplier=Element14
  R21: Composition: Thick Film; ComponentLink1URL: https://datasheet.ciiva.com/2452/pyu-r-int-thick-7-2452770.pdf?src-supplier=Digi-Key; ComponentLink1Description: https://datasheet.ciiva.com/2452/pyu-r-int-thick-7-2452770.pdf?src-supplier=Digi-Key; ComponentLink2URL: https://datasheet.ciiva.com/2452/pyu-r-int-thick-7-2452771.pdf?src-supplier=Digi-Key; ComponentLink2Description: https://datasheet.ciiva.com/2452/pyu-r-int-thick-7-2452771.pdf?src-supplier=Digi-Key; ComponentLink3URL: https://datasheet.ciiva.com/2452/pyu-r-int-thick-7-2452772.pdf?src-supplier=Digi-Key; ComponentLink3Description: https://datasheet.ciiva.com/2452/pyu-r-int-thick-7-2452772.pdf?src-supplier=Digi-Key; ComponentLink4URL: https://datasheet.ciiva.com/7850/1018594-7850181.pdf?src-supplier=Element14; ComponentLink4Description: https://datasheet.ciiva.com/7850/1018594-7850181.pdf?src-supplier=Element14; ComponentLink5URL: https://datasheet.ciiva.com/46394/1018594-46394972.pdf?src-supplier=Element14; ComponentLink5Description: https://datasheet.ciiva.com/46394/1018594-46394972.pdf?src-supplier=Element14; ComponentLink6URL: https://datasheet.ciiva.com/12656/pyu-rc0402-51-rohs-l-6-r-12656926.pdf?src-supplier=Mouser; ComponentLink6Description: https://datasheet.ciiva.com/12656/pyu-rc0402-51-rohs-l-6-r-12656926.pdf?src-supplier=Mouser; ComponentLink7URL: https://datasheet.ciiva.com/15189/getdatasheetpartid-493085-15189862.pdf?src-supplier=Verical; ComponentLink7Description: https://datasheet.ciiva.com/15189/getdatasheetpartid-493085-15189862.pdf?src-supplier=Verical; ComponentLink8URL: https://datasheet.ciiva.com/7746/443971-7746471.pdf?src-supplier=Element14; ComponentLink8Description: https://datasheet.ciiva.com/7746/443971-7746471.pdf?src-supplier=Element14; ComponentLink9URL: https://datasheet.ciiva.com/46394/443971-46394999.pdf?src-supplier=Element14; ComponentLink9Description: https://datasheet.ciiva.com/46394/443971-46394999.pdf?src-supplier=Element14; ComponentLink10URL: https://datasheet.ciiva.com/7746/443971-7746472.pdf?src-supplier=Element14; ComponentLink10Description: https://datasheet.ciiva.com/7746/443971-7746472.pdf?src-supplier=Element14; Height: 0.32mm; ComponentLink11URL: https://datasheet.ciiva.com/7849/1784430-7849810.pdf?src-supplier=Element14; ComponentLink11Description: https://datasheet.ciiva.com/7849/1784430-7849810.pdf?src-supplier=Element14; ComponentLink12URL: https://datasheet.ciiva.com/11808/0900766b80c66297-11808765.pdf?src-supplier=RSComponents; ComponentLink12Description: https://datasheet.ciiva.com/11808/0900766b80c66297-11808765.pdf?src-supplier=RSComponents; ComponentLink13URL: https://datasheet.ciiva.com/12667/pyu-rc0402-51-rohs-l-6-r-12667957.pdf?src-supplier=Mouser; ComponentLink13Description: https://datasheet.ciiva.com/12667/pyu-rc0402-51-rohs-l-6-r-12667957.pdf?src-supplier=Mouser; ComponentLink14URL: https://datasheet.ciiva.com/16740/pyu-rc0402-51-rohs-l-6-r-16740566.pdf?src-supplier=Future+Electronics; ComponentLink14Description: https://datasheet.ciiva.com/16740/pyu-rc0402-51-rohs-l-6-r-16740566.pdf?src-supplier=Future+Electronics; ComponentLink15URL: https://datasheet.ciiva.com/15189/getdatasheetpartid-329466-15189335.pdf?src-supplier=Verical; ComponentLink15Description: https://datasheet.ciiva.com/15189/getdatasheetpartid-329466-15189335.pdf?src-supplier=Verical; ComponentLink16URL: https://datasheet.ciiva.com/22747/1018594-22747511.pdf?src-supplier=Element14; ComponentLink16Description: https://datasheet.ciiva.com/22747/1018594-22747511.pdf?src-supplier=Element14; ComponentLink17URL: https://datasheet.ciiva.com/28367/1018594-28367226.pdf?src-supplier=Element14; ComponentLink17Description: https://datasheet.ciiva.com/28367/1018594-28367226.pdf?src-supplier=Element14
R24 = RES_SMD: RES SMD 100K OHM 1% 1/16W 0402; Manufacturer: Yageo; Manufacturer Part Number: RC0402FR-07100KL; Resistance: 100kR; Power Rating: 63mW; Voltage Rating: 50V; Temperature Coefficient: 100ppm/°C; ComponentLink1URL: https://datasheet.ciiva.com/11808/0900766b80f96399-11808107.pdf?src-supplier=RSComponents; ComponentLink1Description: https://datasheet.ciiva.com/11808/0900766b80f96399-11808107.pdf?src-supplier=RSComponents; ComponentLink2URL: https://datasheet.ciiva.com/7983/443971-7983593.pdf?src-supplier=Element14; ComponentLink2Description: https://datasheet.ciiva.com/7983/443971-7983593.pdf?src-supplier=Element14; ComponentLink3URL: https://datasheet.ciiva.com/46440/1868787-46440889.pdf?src-supplier=Element14; ComponentLink3Description: https://datasheet.ciiva.com/46440/1868787-46440889.pdf?src-supplier=Element14; ComponentLink4URL: https://datasheet.ciiva.com/7746/1738695-7746234.pdf?src-supplier=Element14; ComponentLink4Description: https://datasheet.ciiva.com/7746/1738695-7746234.pdf?src-supplier=Element14; ComponentLink5URL: https://datasheet.ciiva.com/7746/1738695-7746235.pdf?src-supplier=Element14; ComponentLink5Description: https://datasheet.ciiva.com/7746/1738695-7746235.pdf?src-supplier=Element14; ComponentLink6URL: https://datasheet.ciiva.com/22747/443971-22747516.pdf?src-supplier=Element14; ComponentLink6Description: https://datasheet.ciiva.com/22747/443971-22747516.pdf?src-supplier=Element14; Supplier 1: Digi-Key; Supplier Part Number 1: 311-100KJRCT-ND; Stock 1: 3850330; Pricing 1: 1 = 0.10000, 10 = 0.01200, 100 = 0.00480, 1000 = 0.00215, 2500 = 0.00186, 5000 = 0.00154 (USD); RoHS: Yes; Case Code (Metric): 1005; Case Code (Imperial): 0402; Min Operating Temperature: -55°C; Max Operating Temperature: 155°C; Packaging: Tape and Reel; Package Quantity: 1; Resistor Type: Thick Film; Number of Terminations: 2; Termination: SMD/SMT; Max Power Dissipation: 63mW; Features: Moisture Resistant; Length: 1mm; Width: 0.02inch; Height: 0.016inch; Depth: 0.5mm; REACH SVHC: Unknown; Military Standard: Not; Lead Free: Lead Free; ComponentLink7URL: https://datasheet.ciiva.com/7850/1018594-7850133.pdf?src-supplier=Element14; ComponentLink7Description: https://datasheet.ciiva.com/7850/1018594-7850133.pdf?src-supplier=Element14; ComponentLink8URL: https://datasheet.ciiva.com/2491/pyu-r-int-thick-7-2491207.pdf?src-supplier=Digi-Key; ComponentLink8Description: https://datasheet.ciiva.com/2491/pyu-r-int-thick-7-2491207.pdf?src-supplier=Digi-Key; ComponentLink9URL: https://datasheet.ciiva.com/2491/pyu-r-int-thick-7-2491208.pdf?src-supplier=Digi-Key; ComponentLink9Description: https://datasheet.ciiva.com/2491/pyu-r-int-thick-7-2491208.pdf?src-supplier=Digi-Key; ComponentLink10URL: https://datasheet.ciiva.com/2491/pyu-r-int-thick-7-2491209.pdf?src-supplier=Digi-Key; ComponentLink10Description: https://datasheet.ciiva.com/2491/pyu-r-int-thick-7-2491209.pdf?src-supplier=Digi-Key; ComponentLink11URL: https://datasheet.ciiva.com/17052/pyu-rc0402-51-rohs-l-6-r-17052137.pdf?src-supplier=Future+Electronics; ComponentLink11Description: https://datasheet.ciiva.com/17052/pyu-rc0402-51-rohs-l-6-r-17052137.pdf?src-supplier=Future+Electronics; ComponentLink12URL: https://datasheet.ciiva.com/12668/pyu-rc0402-51-rohs-l-6-r-12668218.pdf?src-supplier=Mouser; ComponentLink12Description: https://datasheet.ciiva.com/12668/pyu-rc0402-51-rohs-l-6-r-12668218.pdf?src-supplier=Mouser; ComponentLink13URL: https://datasheet.ciiva.com/46394/1018594-46394941.pdf?src-supplier=Element14; ComponentLink13Description: https://datasheet.ciiva.com/46394/1018594-46394941.pdf?src-supplier=Element14
R26 = RES_SMD: RES SMD 33 OHM 1% 1/16W 0402; Manufacturer 1: Yageo; Manufacturer Part Number 1: RC0402FR-0733RL; Mouting Technology: SMT; Power Rating: 62.5mW; Voltage Rating: 50V; Temperature Coefficient: 100ppm/°C; Max Power Dissipation: 63mW; Pin: 2; Supplier 1: Digi-Key; Supplier Part Number 1: 311-33.0LRCT-ND; RoHS: Yes; Category: Chip SMD Resistors; Stock 1: 1820701; Pricing 1: 1=0.10000, 10=0.01600, 100=0.00660, 1000=0.00299, 2500=0.00259, 5000=0.00214 (USD); Case/Package: 0402; Number of Pins: 2; Case Code (Imperial): 0402; Case Code (Metric): 1005; Min Operating Temperature: -55°C; Max Operating Temperature: 155°C; Resistor Type: Thick Film; Resistance: 33R; Packaging: Tape and Reel; Voltage Rating (DC): 50V; Package Quantity: 10000; Termination: SMD/SMT; Features: Moisture Resistant; Series: RC; Number of Terminations: 2; Resistance Tolerance: 1%; Construction: Rectangular; Technology: THICK FILM; Length: 1mm; Width: 0.5mm; Height: 0.35mm; Depth: 0.5mm; RoHS Compliant: Yes; REACH SVHC: Unknown; Military Standard: Not; Lead Free: Lead Free; ComponentLink1URL: https://datasheet.ciiva.com/11819/0900766b80c66297-11819487.pdf?src-supplier=RSComponents; ComponentLink1Description: https://datasheet.ciiva.com/11819/0900766b80c66297-11819487.pdf?src-supplier=RSComponents; ComponentLink2URL: https://datasheet.ciiva.com/15189/getdatasheetpartid-329253-15189431.pdf?src-supplier=Verical; ComponentLink2Description: https://datasheet.ciiva.com/15189/getdatasheetpartid-329253-15189431.pdf?src-supplier=Verical; ComponentLink3URL: https://datasheet.ciiva.com/24070/pyu-rc0402-51-rohs-l-6-r-8721-24070077.pdf?src-supplier=Mouser; ComponentLink3Description: https://datasheet.ciiva.com/24070/pyu-rc0402-51-rohs-l-6-r-8721-24070077.pdf?src-supplier=Mouser; ComponentLink4URL: https://datasheet.ciiva.com/7849/1018594-7849966.pdf?src-supplier=Element14; ComponentLink4Description: https://datasheet.ciiva.com/7849/1018594-7849966.pdf?src-supplier=Element14; ComponentLink5URL: https://datasheet.ciiva.com/7849/1018594-7849967.pdf?src-supplier=Element14; ComponentLink5Description: https://datasheet.ciiva.com/7849/1018594-7849967.pdf?src-supplier=Element14; ComponentLink6URL: https://datasheet.ciiva.com/17070/pyu-rc0402-51-rohs-l-6-r-17070335.pdf?src-supplier=Future+Electronics; ComponentLink6Description: https://datasheet.ciiva.com/17070/pyu-rc0402-51-rohs-l-6-r-17070335.pdf?src-supplier=Future+Electronics
SW1 SW2 = A08-0790: SWITCH TACTILE SPST-NO 0.05A 16V; Manufacturer: C&K; Switch Function: Off-Mom; Contact Rating @ Voltage: 0.05A @ 16VDC; Actuator Type: Standard; Actuator Height off PCB, Vertical: 2.50mm; Actuator Orientation: Top Actuated; Outline: 4.20mm x 3.20mm; Illumination: Non-Illuminated; Operating Force: 260gf; Switch Travel: 0.15mm; Mechanical Life: 50,000 Cycles; Supplier 1: Digi-Key; Supplier Part Number 1: CKN10503CT-ND; Manufacturer Part Number: PTS810 SJK 250 SMTR LFS; RoHS: RoHS Compliant; Category: Switches; Stock 1: 75516; Pricing 1: 1=0.3, 10=0.287, 25=0.2768, 50=0.267, 100=0.2521, 250=0.23728, 500=0.2274, 1000=0.17302 (USD); Packaging: Cut Tape (CT); Part Status: Active; Circuit: SPST-NO; Mounting Type: Surface Mount; Actuator Length, Right Angle: -; Termination Style: J Lead; Illumination Type, Color: -; Illumination Voltage (Nominal): -; Ingress Protection: -; Features: -; Operating Temperature: -40°C ~ 85°C; Actuator Material: -; ComponentLink1URL: https://www.ckswitches.com/media/1476/pts810.pdf; ComponentLink1Description: https://www.ckswitches.com/media/1476/pts810.pdf
U3 = ESP32-S: RX TXRX MOD WIFI TRACE ANT SMD; Manufacturer: Espressif Systems; Interface: I2C,SPI,GPIO,PWM,SDIO,UART; Frequency: 2.5GHz; Data Rate: 150Mbps; Sensitivity: -98dBm; Memory Size: 536KB; ComponentLink1URL: https://www.espressif.com/sites/default/files/documentation/esp32-wroom-32d_esp32-wroom-32u_datasheet_en.pdf?src-supplier=Digi-Key; ComponentLink1Description: https://www.espressif.com/sites/default/files/documentation/esp32-wroom-32d_esp32-wroom-32u_datasheet_en.pdf?src-supplier=Digi-Key; Supplier 1: Digi-Key; Supplier Part Number 1: 1904-1025-1-ND; Manufacturer Part Number: ESP32-WROOM-32D (16MB); Stock 1: 6133; Pricing 1: 1 = 4.50000 (USD); RoHS: No; Mount: Surface Mount; Case/Package: SMD/SMT; Min Operating Temperature: -40°C; Max Operating Temperature: 85°C; Packaging: Tape and Reel
U4 = LSM6DSL: IMU ACCEL/GYRO I2C/SPI 14LGA; Manufacturer 1: STMicroelectronics; Manufacturer Part Number 1: LSM6DSLTR; Sensor Type: Accelerometer,Gyroscope,3 Axis,Temperature; Output Type: SPI,I2C; Supplier 1: Digi-Key; RoHS: Yes; Category: Inertial Measurement Units (IMUs); Pricing 1: 1=5.27000, 10=4.73000, 25=4.47200, 100=3.87560, 250=3.67688, 500=3.29924, 1000=3.28125 (USD); Mount: Surface Mount; Case/Package: LGA; Min Operating Temperature: -40°C; Max Operating Temperature: 85°C; Packaging: Tape and Reel; RoHS Compliant: Yes; ComponentLink1URL: http://www.farnell.com/datasheets/2290668.pdf?src-supplier=Farnell; ComponentLink1Description: http://www.farnell.com/datasheets/2290668.pdf?src-supplier=Farnell; ComponentLink2URL: https://www.mouser.com/ds/2/389/lsm6dsl-973708.pdf?src-supplier=Mouser; ComponentLink2Description: https://www.mouser.com/ds/2/389/lsm6dsl-973708.pdf?src-supplier=Mouser; ComponentLink3URL: http://www.st.com/content/ccc/resource/technical/document/datasheet/ee/23/a0/dc/1d/68/45/52/DM00237456.pdf/files/DM00237456.pdf/jcr:content/translations/en.DM00237456.pdf?src-supplier=Digi-Key; ComponentLink3Description: http://www.st.com/content/ccc/resource/technical/document/datasheet/ee/23/a0/dc/1d/68/45/52/DM00237456.pdf/files/DM00237456.pdf/jcr:content/translations/en.DM00237456.pdf?src-supplier=Digi-Key; ComponentLink4URL: http://www.farnell.com/datasheets/2290668.pdf?src-supplier=Newark; ComponentLink4Description: http://www.farnell.com/datasheets/2290668.pdf?src-supplier=Newark; ComponentLink5URL: http://www.farnell.com/datasheets/2290668.pdf?src-supplier=Element14; ComponentLink5Description: http://www.farnell.com/datasheets/2290668.pdf?src-supplier=Element14; Supplier Part Number 1: 497-16705-1-ND

## Nets that join several sheets
+3.3V: Power Supply (C9.2 R6.1 R8.1 U2.5), ESP32 (21 pins)
GND: Power Supply (26 pins), ESP32 (29 pins)
ADC_VBAT: Power Supply (C7.2 R9.1 R10.2), ESP32 (U3.6)
CHARGE_PGOOD: Power Supply (R6.2 U1.7), ESP32 (U3.8)
CHARGE_STAT: Power Supply (R8.2 U1.9), ESP32 (U3.7)